# Altium schematic sheet schematic.SchDoc
size A4; SheetNumber: 1; SheetTotal: 1
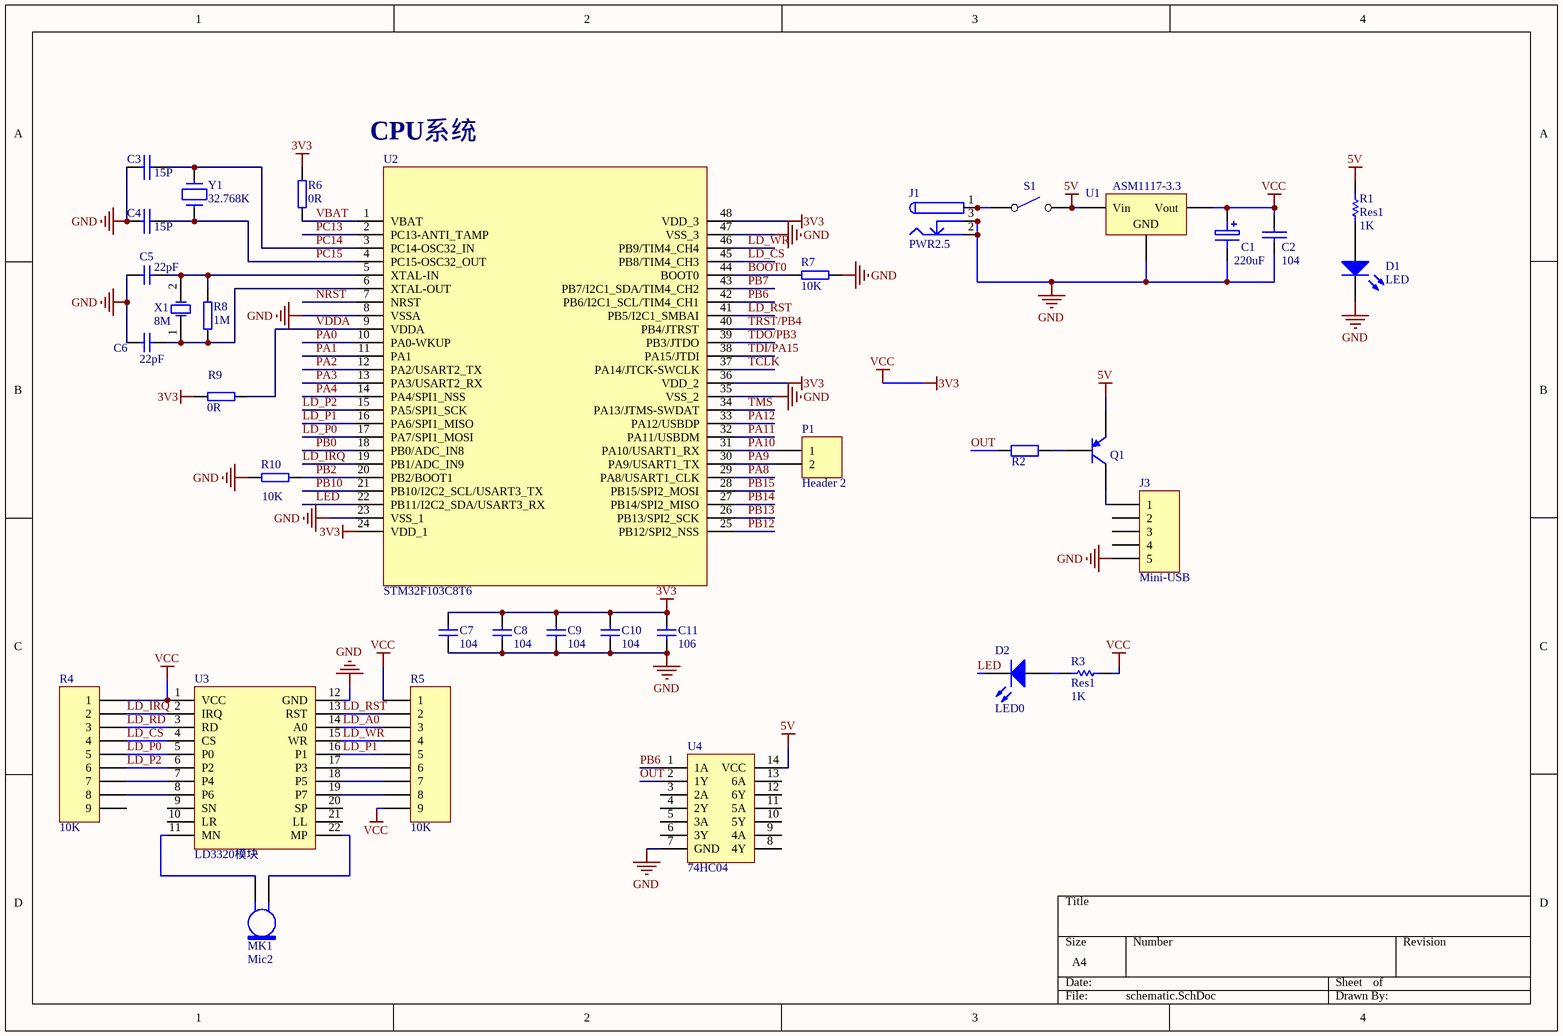
[diagram p0: schematic.SchDoc]

## Parts
C1  220uF  [C0805]
C2  104  [C0805]
C3  15P  [C0805]
C4  15P  [C0805]
C5  22pF  [C0805]
C6  22pF  [C0805]
C7  104  [C0805]
C8  104  [C0805]
C9  104  [C0805]
C10  104  [C0805]
C11  106  [C0805]
D1  LED  [LED_0805]
D2  LED0  [LED_0805]
J1  PWR2.5  [DC-005]
J3  Mini-USB  [USB1 - duplicate]
MK1  Mic2  [PIN2]
P1  Header 2  [HDR1X2]
Q1  S8550  [SOT-23]  (value not drawn)
R1  Res1  value 1K  [R0805]
R2  200R  [R0805]  (value not drawn)
R3  Res1  value 1K  [R0805]
R4  10K  [HDR1X9]
R5  10K  [HDR1X9]
R6  0R  [R0805]
R7  10K  [R0805]
R8  1M  [R0805]
R9  0R  [R0805]
R10  10K  [R0805]
S1  SW-SPST  [BTN8.5*8.5]  (value not drawn)
U1  ASM1117-3.3  [SOT-223]
U2  STM32F103C8T6  [48P]
U3  LD3320模块  [HDR2X11_CEN]
U4  74HC04  [SOP14_M]
X1  8M  [XTAL]
Y1  32.768K  [HDR1X2]

## Nets
3V3: C1.1 C2.1 C7.1 C8.1 C9.1 C10.1 C11.1 R3.2 R4.1 R5.1 R5.9 R6.2 R9.2 U1.2(Vout) U2.24(VDD_1) U2.36(VDD_2) U2.48(VDD_3) U3.1(VCC)  [also labelled VCC]
5V: Q1.2(E) R1.1 S1.2 U1.3(Vin) U4.14(VCC)
GND: C1.2(E) C2.2 C3.1 C4.1 C5.2 C6.2 C7.2 C8.2 C9.2 C10.2 C11.2 D1.2(K) J1.2 J1.2A J1.2B J1.3 J1.3A J1.3B J3.5 R7.1 R10.2 U1.1(GND) U2.8(VSSA) U2.23(VSS_1) U2.35(VSS_2) U2.47(VSS_3) U3.12(GND) U4.7(GND)
BOOT0: R7.2 U2.44(BOOT0)
LD_A0: R5.3 U3.14(A0)
LD_CS: R4.4 U2.45(PB8/TIM4_CH3) U3.4(CS)
LD_IRQ: R4.2 U2.19(PB1/ADC_IN9) U3.2(IRQ)
LD_P0: R4.5 U2.17(PA7/SPI1_MOSI) U3.5(P0)
LD_P1: R5.5 U2.16(PA6/SPI1_MISO) U3.16(P1)
LD_P2: R4.6 U2.15(PA5/SPI1_SCK) U3.6(P2)
LD_RD: R4.3 U3.3(RD)
LD_RST: R5.2 U2.41(PB5/I2C1_SMBAI) U3.13(RST)
LD_WR: R5.4 U2.46(PB9/TIM4_CH4) U3.15(WR)
LED: D2.2(K) U2.22(PB11/I2C2_SDA/USART3_RX)
NRST: U2.7(NRST)
OUT: R2.1 U4.2(1Y)
PA0: U2.10(PA0-WKUP)
PA1: U2.11(PA1)
PA2: U2.12(PA2/USART2_TX)
PA3: U2.13(PA3/USART2_RX)
PA4: U2.14(PA4/SPI1_NSS)
PA8: U2.29(PA8/USART1_CLK)
PA9: P1.2 U2.30(PA9/USART1_TX)
PA10: P1.1 U2.31(PA10/USART1_RX)
PA11: U2.32(PA11/USBDM)
PA12: U2.33(PA12/USBDP)
PB0: U2.18(PB0/ADC_IN8)
PB2: R10.1 U2.20(PB2/BOOT1)
PB6: U2.42(PB6/I2C1_SCL/TIM4_CH1) U4.1(1A)
PB7: U2.43(PB7/I2C1_SDA/TIM4_CH2)
PB10: U2.21(PB10/I2C2_SCL/USART3_TX)
PB12: U2.25(PB12/SPI2_NSS)
PB13: U2.26(PB13/SPI2_SCK)
PB14: U2.27(PB14/SPI2_MISO)
PB15: U2.28(PB15/SPI2_MOSI)
PC13: U2.2(PC13-ANTI_TAMP)
PC14: C3.2 U2.3(PC14-OSC32_IN) Y1.2
PC15: C4.2 U2.4(PC15-OSC32_OUT) Y1.1
TCLK: U2.37(PA14/JTCK-SWCLK)
TDI/PA15: U2.38(PA15/JTDI)
TDO/PB3: U2.39(PB3/JTDO)
TMS: U2.34(PA13/JTMS-SWDAT)
TRST/PB4: U2.40(PB4/JTRST)
VBAT: R6.1 U2.1(VBAT)
VDDA: R9.1 U2.9(VDDA)
NetC5_1: C5.1 R8.2 U2.5(XTAL-IN) X1.2
NetC6_1: C6.1 R8.1 U2.6(XTAL-OUT) X1.1
NetD1_1: D1.1(A) R1.2
NetD2_1: D2.1(A) R3.1
NetJ1_1: J1.1 J1.1A J1.1B S1.3
NetJ3_1: J3.1 Q1.3
NetMK1_1: MK1.1 U3.22(MP)
NetMK1_2: MK1.2 U3.11(MN)
NetQ1_1: Q1.1(B) R2.2
NetR4_7: R4.7 U3.7(P4)
NetR4_8: R4.8 U3.8(P6)
NetR5_6: R5.6 U3.17(P3)
NetR5_7: R5.7 U3.18(P5)
NetR5_8: R5.8 U3.19(P7)

Not connected (* = marked no-connect by the designer): J3 2 3 4; R4 9; U3 9(SN) 10(LR) 20(SP) 21(LL); U4 3(2A) 4(2Y) 5(3A) 6(3Y) 8(4Y) 9(4A) 10(5Y) 11(5A) 12(6Y) 13(6A)

## Notes on the sheet
- CPU系统

## Library data of the parts
C1 = 有极性电容: 10uF
C2 = 无极性电容: 30pF
C3 C4 = CAP
C5 C6 = CAP1: Capacitor; Tolerate: 50V; Value: 20pF; TOL: 2%; ERP: 0103020090; PCB_Layout: Top Layer SMC; Revision: 2012-3-28; Publisher: ZL_A0OFFICE
C7-C11 = CAP1: Capacitor; Tolerate: 50V; Value: 100nF; TOL: 10%; ERP: 0103020075; PCB_Layout: Top Layer SMC; Revision: 2012-3-28; Publisher: ZL_A0OFFICE
D1 D2 = LED0: Typical INFRARED GaAs LED; Published: 8-Jun-2000; LatestRevisionDate: 08-Jul-2005; LatestRevisionNote: Mech Layer 1 removed.; PackageReference: LED-0; Publisher: Altium Limited
J1 = PWR2.5: Low Voltage Power Supply Connector; Published: 17-Dec-2003; DatasheetDocument: 09-May-2002; Publisher: Altium Limited; ComponentLink1Description: Manufacturer Link; ComponentLink1URL: http://domino.kycon.com/internet/Products.html
J3 = Header 5: Header, 5-Pin
MK1 = Mic2: Microphone; Published: 24-Mar-1999; LatestRevisionDate: 17-Jul-2002; LatestRevisionNote: Re-released for DXP Platform.; PackageReference: PIN2; Publisher: Altium Limited
P1 = Header 2: Header, 2-Pin; LatestRevisionDate: 17-Jul-2002; LatestRevisionNote: Re-released for DXP Platform.; Publisher: Altium Limited
Q1 = PNP: PNP三极管
R1 R3 = Res1: Resistor; Published: 8-Jun-2000; LatestRevisionDate: 17-Jul-2002; LatestRevisionNote: Re-released for DXP Platform.; PackageReference: AXIAL-0.3; Publisher: Altium Limited
R2 = Resistor: DIP
R4 R5 = Header 9: Header, 9-Pin; LatestRevisionDate: 17-Jul-2002; LatestRevisionNote: Re-released for DXP Platform.; Publisher: Altium Limited
R6-R10 = R
U1 = Volt Reg: Voltage Regulator; Published: 24-Mar-1999; LatestRevisionDate: 29-May-2009; LatestRevisionNote: IPC-7351 Footprint Added.; PackageReference: D2PAK; Publisher: Altium Limited; PackageDescription: 3-Pin Transistor Outline Package 2.54 mm Pitch, 15.1 mm Lead Span
U3 = LD3320模块2
U4 = 74HC05
X1 = XTAL_SMD: Crystal Oscillator; ERP: 0103040021; Value: 8MHz; TOL: ±20ppm; Tolerate: ROSON -20_+70 20pf; PCB_Layout: Top Layer SMC; Publisher: ZL_A0OFFICE; Revision: 2012-3-28
Y1 = CRYSTAL: 晶振